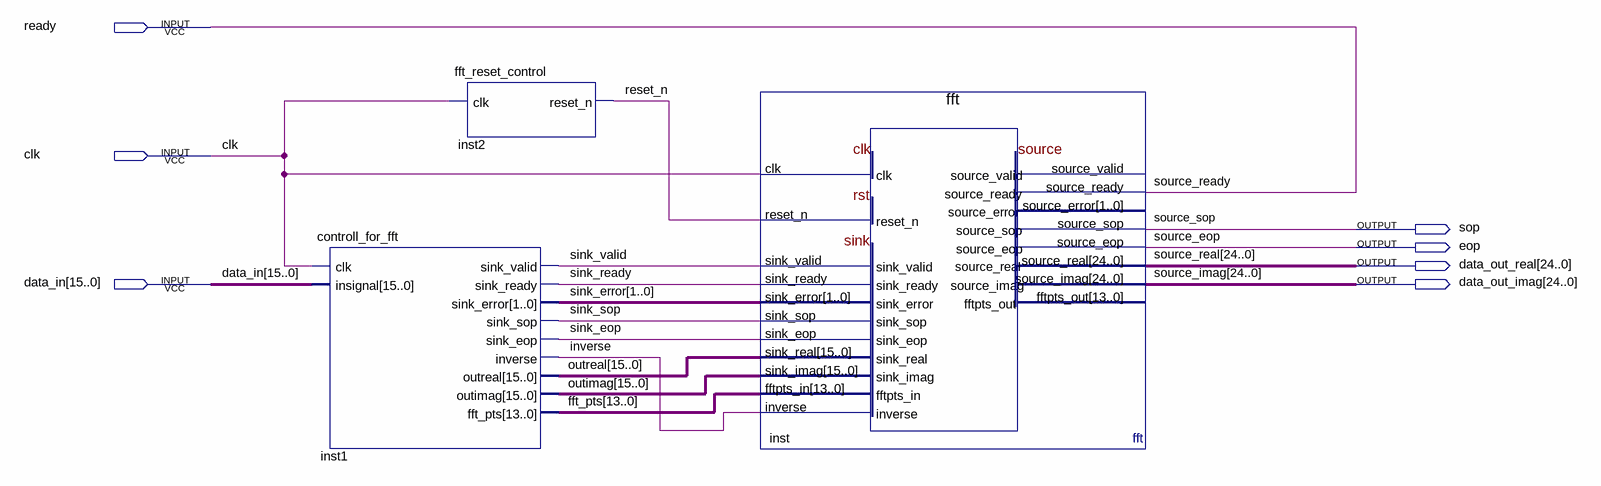
[diagram p0: schematic sheet]
// Quartus schematic ftt_interface.bdf as structural Verilog: 3 symbols, 7 pins
module ftt_interface (
  input  ready,
  input  clk,
  input  [15:0] data_in,
  output sop,
  output eop,
  output [24:0] data_out_real,
  output [24:0] data_out_imag
);

  wire inverse, reset_n, sink_eop, sink_ready, sink_sop, sink_valid;
  wire [1:0] sink_error;
  wire [13:0] fft_pts;
  wire [15:0] outimag, outreal;

  controll_for_fft inst1 (
    .clk(clk), .insignal(data_in), .sink_valid(sink_valid), .sink_ready(sink_ready), .sink_error(sink_error),
    .sink_sop(sink_sop), .sink_eop(sink_eop), .inverse(inverse), .outreal(outreal), .outimag(outimag),
    .fft_pts(fft_pts));
  fft_reset_control inst2 (.clk(clk), .reset_n(reset_n));
  fft inst (
    .clk(clk), .reset_n(reset_n), .sink_valid(sink_valid), .sink_error(sink_error), .sink_sop(sink_sop),
    .sink_eop(sink_eop), .sink_real(outreal), .sink_imag(outimag), .fftpts_in(fft_pts), .inverse(inverse),
    .source_ready(ready), .sink_ready(sink_ready), .source_sop(sop), .source_eop(eop),
    .source_real(data_out_real), .source_imag(data_out_imag));  // open: source_valid, source_error, fftpts_out

  // Other names for the same wires on the sheet: source_eop = eop; source_imag[24:0] = data_out_imag;
  //   source_ready = ready; source_real[24:0] = data_out_real; source_sop = sop
endmodule
